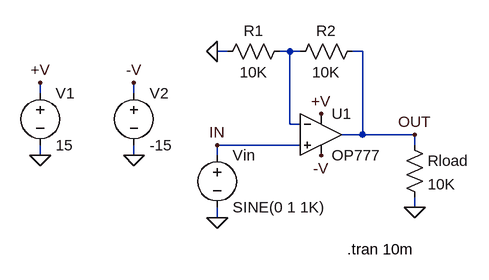
[diagram p0: schematic OP777.asc]
OP777.asc, the LTspice schematic file:
Version 4
SHEET 1 1240 700
WIRE 432 -1232 416 -1232
WIRE 528 -1232 512 -1232
WIRE 544 -1232 528 -1232
WIRE 640 -1232 624 -1232
WIRE 144 -1168 144 -1184
WIRE 288 -1168 288 -1184
WIRE 528 -1120 528 -1232
WIRE 544 -1120 528 -1120
WIRE 640 -1104 640 -1232
WIRE 640 -1104 608 -1104
WIRE 720 -1104 640 -1104
WIRE 544 -1088 416 -1088
WIRE 720 -1088 720 -1104
WIRE 144 -1072 144 -1088
WIRE 288 -1072 288 -1088
WIRE 416 -1072 416 -1088
WIRE 720 -992 720 -1008
WIRE 416 -976 416 -992
FLAG 144 -1184 +V
FLAG 144 -1072 0
FLAG 416 -976 0
FLAG 720 -1104 OUT
FLAG 416 -1088 IN
FLAG 576 -1136 +V
FLAG 288 -1184 -V
FLAG 576 -1072 -V
FLAG 416 -1232 0
FLAG 720 -992 0
FLAG 288 -1072 0
SYMBOL voltage 144 -1184 R0
WINDOW 123 0 0 Left 2
WINDOW 39 0 0 Left 2
SYMATTR InstName V1
SYMATTR Value 15
SYMBOL voltage 416 -1088 R0
WINDOW 123 24 146 Left 2
WINDOW 39 24 125 Left 2
SYMATTR InstName Vin
SYMATTR Value SINE(0 1 1K)
SYMBOL res 528 -1248 R90
WINDOW 0 0 56 VBottom 2
WINDOW 3 32 56 VTop 2
SYMATTR InstName R1
SYMATTR Value 10K
SYMBOL res 640 -1248 R90
WINDOW 0 0 56 VBottom 2
WINDOW 3 32 56 VTop 2
SYMATTR InstName R2
SYMATTR Value 10K
SYMBOL Opamps\\OP777 576 -1168 R0
SYMATTR InstName U1
SYMBOL voltage 288 -1184 R0
WINDOW 123 24 146 Left 2
WINDOW 39 24 125 Left 2
SYMATTR InstName V2
SYMATTR Value -15
SYMBOL res 704 -1104 R0
SYMATTR InstName Rload
SYMATTR Value 10K
TEXT 616 -928 Left 2 !.tran 10m

The netlist it stands for:
* OP777.asc
V1 +V 0 15
Vin IN 0 SINE(0 1 1K)
R1 N001 0 10K
R2 OUT N001 10K
XU1 IN N001 +V -V OUT OP777  ; pins In+ In- V+ V- OUT
V2 -V 0 -15
Rload OUT 0 10K
.tran 10m
.lib ADI.lib
.backanno
.end